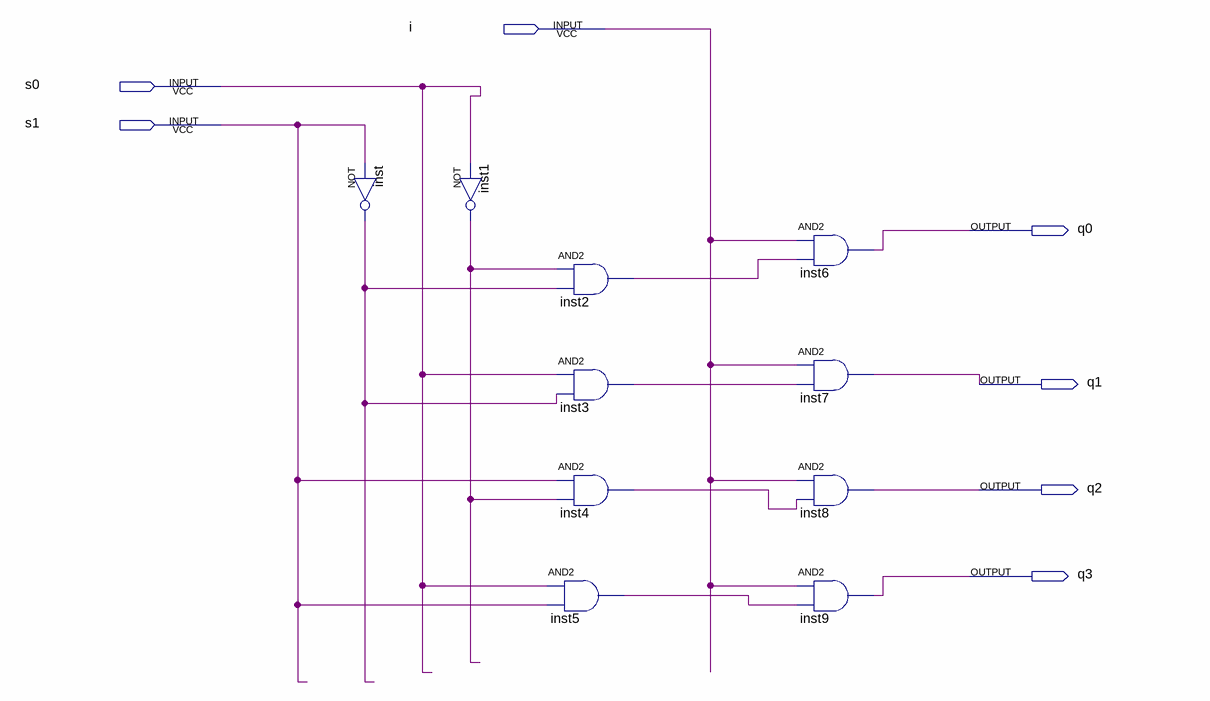
[diagram p0: schematic sheet]
// Quartus schematic hw603.bdf as structural Verilog: 10 symbols, 7 pins
module hw603 (
  input  i,
  input  s0,
  input  s1,
  output q0,
  output q1,
  output q2,
  output q3
);

  wire inst1_out, inst2_out, inst3_out, inst4_out, inst5_out, inst_out;

  not inst (inst_out, s1);
  not inst1 (inst1_out, s0);
  and inst2 (inst2_out, inst1_out, inst_out);
  and inst3 (inst3_out, s0, inst_out);
  and inst4 (inst4_out, s1, inst1_out);
  and inst5 (inst5_out, s0, s1);
  and inst6 (q0, i, inst2_out);
  and inst7 (q1, i, inst3_out);
  and inst8 (q2, i, inst4_out);
  and inst9 (q3, i, inst5_out);
endmodule
